# Altium schematic sheet keypad.SchDoc
size A
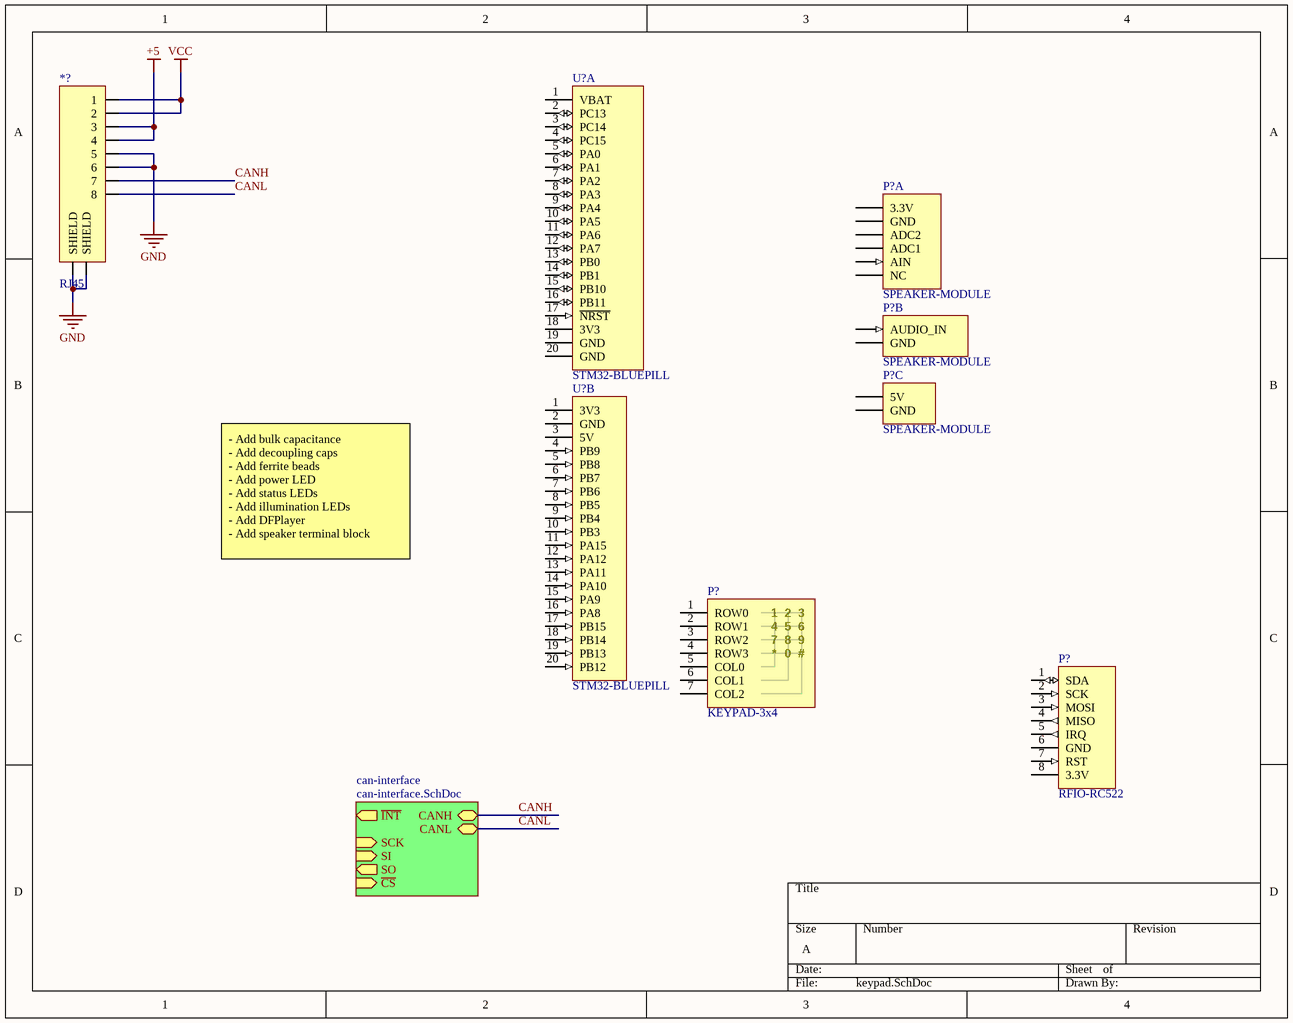
[diagram p0: keypad.SchDoc]

## Parts
(Parts that share a designator on the sheet are numbered #1, #2 ... from top to bottom, then left to right.)
*?  RJ45
P?#1  SPEAKER-MODULE  (part A of 3)
P?#2  SPEAKER-MODULE  (part B of 3)
P?#3  SPEAKER-MODULE  (part C of 3)
P?#4  KEYPAD-3x4
P?#5  RFIO-RC522
U?#1  STM32-BLUEPILL  (part A of 2)
U?#2  STM32-BLUEPILL  (part B of 2)

## Sub-sheets
can-interface = can-interface.SchDoc: SO (out), SI (in), CANH (bidir), ~{CS} (in), CANL (bidir), SCK (in), ~{INT} (out)

## Nets
+5: *?.3 *?.4
GND: *?.5 *?.6 *?.9(SHIELD) *?.10(SHIELD)
VCC: *?.1 *?.2
CANH: *?.7 ; sheet can-interface/CANH
CANL: *?.8 ; sheet can-interface/CANL

Not connected (* = marked no-connect by the designer): P?#1 1(3.3V) 2(GND) 3(ADC2) 4(ADC1) 5(AIN) 6(NC); P?#2 1(AUDIO_IN) 2(GND); P?#3 1(5V) 2(GND); P?#4 1(ROW0) 2(ROW1) 3(ROW2) 4(ROW3) 5(COL0) 6(COL1) 7(COL2); P?#5 1(SDA) 2(SCK) 3(MOSI) 4(MISO) 5(IRQ) 6(GND) 7(RST) 8(3.3V); U?#1 1(VBAT) 2(PC13) 3(PC14) 4(PC15) 5(PA0) 6(PA1) 7(PA2) 8(PA3) 9(PA4) 10(PA5) 11(PA6) 12(PA7) 13(PB0) 14(PB1) 15(PB10) 16(PB11) 17(~{NRST}) 18(3V3) 19(GND) 20(GND); U?#2 1(3V3) 2(GND) 3(5V) 4(PB9) 5(PB8) 6(PB7) 7(PB6) 8(PB5) 9(PB4) 10(PB3) 11(PA15) 12(PA12) 13(PA11) 14(PA10) 15(PA9) 16(PA8) 17(PB15) 18(PB14) 19(PB13) 20(PB12)

## Notes on the sheet
- - Add bulk capacitance
  - Add decoupling caps
  - Add ferrite beads
  - Add power LED
  - Add status LEDs
  - Add illumination LEDs
  - Add DFPlayer
  - Add speaker terminal block
- (in symbol KEYPAD-3x4) 8; 9; 0; #

## Library data of the parts
P?#1-P?#3 = SPEAKER-MODULE: Speaker
P?#4 = KEYPAD-3x4: 3x4 matrix keypad
P?#5 = RFIO-RC522: RFIO-RC522 MFRC522
U?#1 U?#2 = STM32-BLUEPILL: STM32 Bluepill